# EAGLE schematic 4x1button v19 (EAGLE 9.7.0)

## Sheet 1 of 5
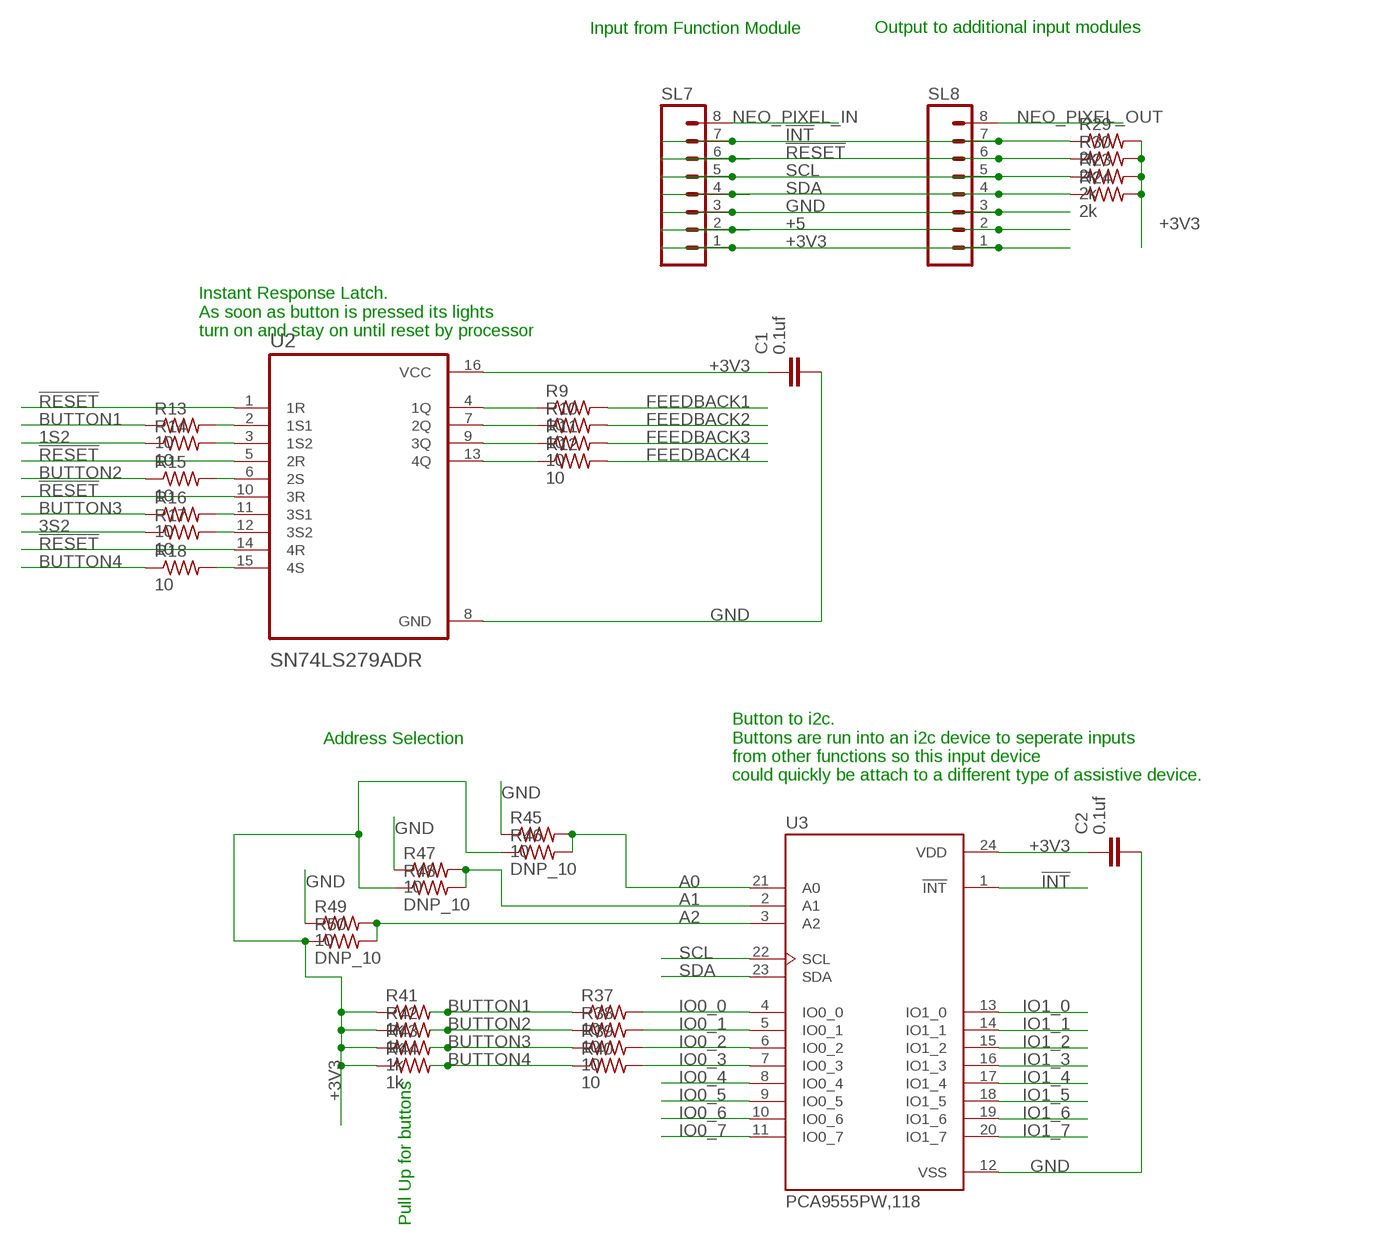
[diagram p0: schematic, sheet 1]

### Parts
C1  0.1uf  C_CHIP-0805(2012-METRIC)  [CAPC2012X110]
C2  0.1uf  C_CHIP-0805(2012-METRIC)  [CAPC2012X110]
R9  10  R-US_R0805  [R0805]
R10  10  R-US_R0805  [R0805]
R11  10  R-US_R0805  [R0805]
R12  10  R-US_R0805  [R0805]
R13  10  R-US_R0805  [R0805]
R14  10  R-US_R0805  [R0805]
R15  10  R-US_R0805  [R0805]
R16  10  R-US_R0805  [R0805]
R17  10  R-US_R0805  [R0805]
R18  10  R-US_R0805  [R0805]
R23  2k  R-US_R0805  [R0805]
R24  2k  R-US_R0805  [R0805]
R29  2k  R-US_R0805  [R0805]
R30  2k  R-US_R0805  [R0805]
R37  10  R-US_R0805  [R0805]
R38  10  R-US_R0805  [R0805]
R39  10  R-US_R0805  [R0805]
R40  10  R-US_R0805  [R0805]
R41  1k  R-US_R0805  [R0805]
R42  1k  R-US_R0805  [R0805]
R43  1k  R-US_R0805  [R0805]
R44  1k  R-US_R0805  [R0805]
R45  10  R-US_R0805  [R0805]
R46  DNP_10  R-US_R0805  [R0805]
R47  10  R-US_R0805  [R0805]
R48  DNP_10  R-US_R0805  [R0805]
R49  10  R-US_R0805  [R0805]
R50  DNP_10  R-US_R0805  [R0805]
SL7  MA08  [08PA]
SL8  MA08  [08PA]
U2  SN74LS279ADR  [SOIC127P600X175-16N]
U3  PCA9555PW,118  [SOP65P640X110-24N]

### Nets
1S2: R14.1
3S2: R17.1
!INT: R29.1 SL7.7 SL8.7 U3.1(!INT)
!RESET: R30.1 SL7.6 SL8.6 U2.1(1R) U2.5(2R) U2.10(3R) U2.14(4R)
+3V3: C1.1 C2.1 R23.2 R24.2 R29.2 R30.2 R41.1 R42.1 R43.1 R44.1 R46.1 R48.1 R50.1 SL7.1 SL8.1 U2.16(VCC) U3.24(VDD) ; also sheet 2,3,4,5
+5: SL7.2 SL8.2 ; also sheet 2,3,4,5
A0: R45.2 R46.2 U3.21(A0)
A1: R47.2 R48.2 U3.2(A1)
A2: R49.2 R50.2 U3.3(A2)
BUTTON1: R13.1 R37.1 R41.2 ; also sheet 2
BUTTON2: R15.1 R38.1 R42.2 ; also sheet 3
BUTTON3: R16.1 R39.1 R43.2 ; also sheet 4
BUTTON4: R18.1 R40.1 R44.2 ; also sheet 5
FEEDBACK1: R9.2 ; also sheet 2
FEEDBACK2: R10.2 ; also sheet 3
FEEDBACK3: R11.2 ; also sheet 4
FEEDBACK4: R12.2 ; also sheet 5
GND: C1.2 C2.2 R45.1 R47.1 R49.1 SL7.3 SL8.3 U2.8(GND) U3.12(VSS) ; also sheet 2,3,4,5
IO0_0: R37.2 U3.4(IO0_0)
IO0_1: R38.2 U3.5(IO0_1)
IO0_2: R39.2 U3.6(IO0_2)
IO0_3: R40.2 U3.7(IO0_3)
IO0_4: U3.8(IO0_4)
IO0_5: U3.9(IO0_5)
IO0_6: U3.10(IO0_6)
IO0_7: U3.11(IO0_7)
IO1_0: U3.13(IO1_0)
IO1_1: U3.14(IO1_1)
IO1_2: U3.15(IO1_2)
IO1_3: U3.16(IO1_3)
IO1_4: U3.17(IO1_4)
IO1_5: U3.18(IO1_5)
IO1_6: U3.19(IO1_6)
IO1_7: U3.20(IO1_7)
N$15: R9.1 U2.4(1Q)
N$16: R10.1 U2.7(2Q)
N$17: R11.1 U2.9(3Q)
N$18: R12.1 U2.13(4Q)
N$19: R13.2 U2.2(1S1)
N$20: R14.2 U2.3(1S2)
N$21: R15.2 U2.6(2S)
N$22: R16.2 U2.11(3S1)
N$23: R17.2 U2.12(3S2)
N$24: R18.2 U2.15(4S)
NEO_PIXEL_IN: SL7.8 ; also sheet 2
NEO_PIXEL_OUT: SL8.8 ; also sheet 5
SCL: R23.1 SL7.5 SL8.5 U3.22(SCL)
SDA: R24.1 SL7.4 SL8.4 U3.23(SDA)

### Notes on the sheet
- Input from Function Module
- Output to additional input modules
- Instant Response Latch.
  As soon as button is pressed its lights
  turn on and stay on until reset by processor
- Address Selection
- Button to i2c.
  Buttons are run into an i2c device to seperate inputs 
  from other functions so this input device 
  could quickly be attach to a different type of assistive device.
- Pull Up for buttons

## Sheet 2 of 5
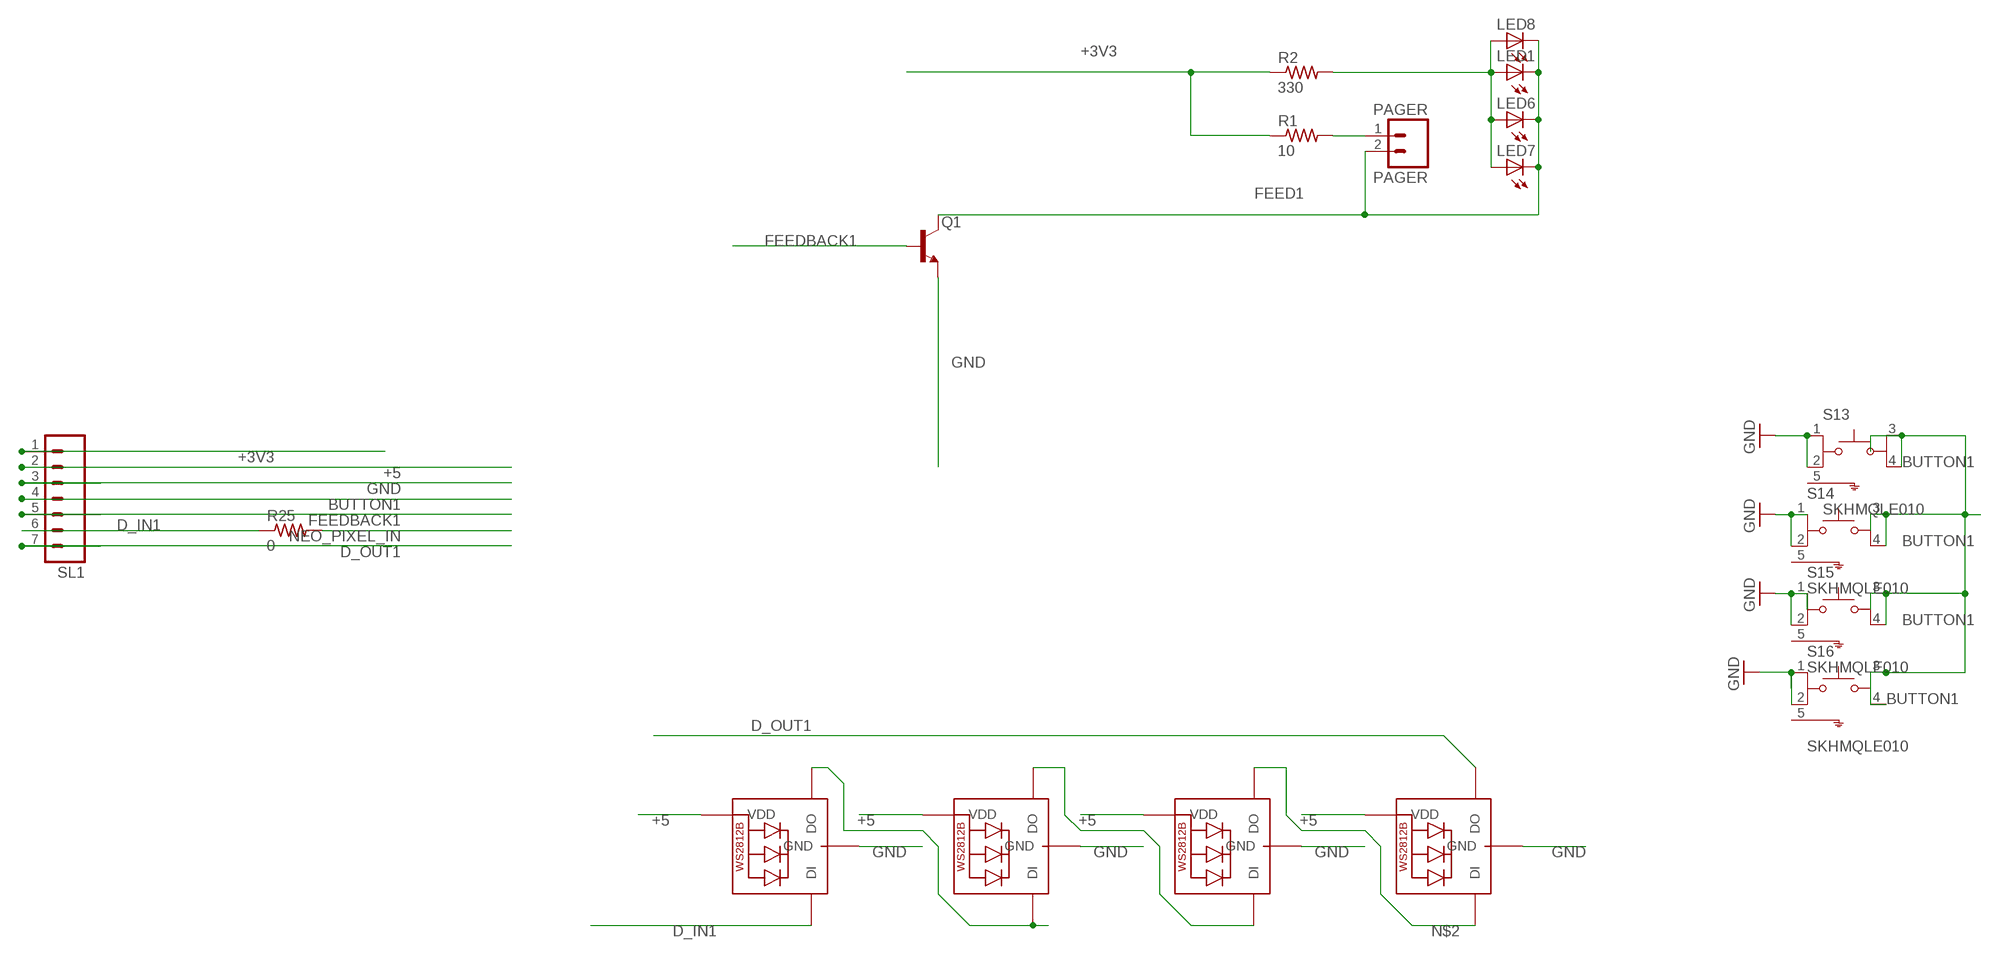
[diagram p1: schematic, sheet 2]

### Parts
LED1  LEDCHIP-LED0805  [CHIP-LED0805]
LED2  WS2812B-V5/W  WS2812B5050  [WS2812B]
LED3  WS2812B-V5/W  WS2812B5050  [WS2812B]
LED4  WS2812B-V5/W  WS2812B5050  [WS2812B]
LED5  WS2812B-V5/W  WS2812B5050  [WS2812B]
LED6  LEDCHIP-LED0805  [CHIP-LED0805]
LED7  LEDCHIP-LED0805  [CHIP-LED0805]
LED8  LEDCHIP-LED0805  [CHIP-LED0805]
PAGER  PAGER  MA02  [02PA]
Q1  MMUN2216  NPN_SOT23-BEC  [SOT95P237X112-3N]
R1  10  R-US_R0805  [R0805]
R2  330  R-US_R0805  [R0805]
R25  0  R-US_R0805  [R0805]
S13  SKHMQLE010  [SW_SKHMQLE010]
S14  SKHMQLE010  [SW_SKHMQLE010]
S15  SKHMQLE010  [SW_SKHMQLE010]
S16  SKHMQLE010  [SW_SKHMQLE010]
SL1  MA07  [07PA]

### Nets
+3V3: R1.1 R2.1 SL1.1 ; also sheet 1,3,4,5
+5: LED2.1-VDD(VDD) LED3.1-VDD(VDD) LED4.1-VDD(VDD) LED5.1-VDD(VDD) SL1.2 ; also sheet 1,3,4,5
BUTTON1: S13.3 S13.4 S14.3 S14.4 S15.3 S15.4 S16.3 S16.4 SL1.4 ; also sheet 1
D_IN1: LED2.4-DIN(DI) R25.1 SL1.6
D_OUT1: LED5.2-DOUT(DO) SL1.7 ; also sheet 3
FEED1: LED1.C LED6.C LED7.C LED8.C PAGER.2 Q1.3(C)
FEEDBACK1: Q1.1(B) SL1.5 ; also sheet 1
GND: LED2.3-GND(GND) LED3.3-GND(GND) LED4.3-GND(GND) LED5.3-GND(GND) Q1.2(E) S13.1 S13.2 S14.1 S14.2 S15.1 S15.2 S16.1 S16.2 SL1.3 ; also sheet 1,3,4,5
N$1: PAGER.1 R1.2
N$2: LED4.2-DOUT(DO) LED5.4-DIN(DI)
N$35: LED1.A LED6.A LED7.A LED8.A R2.2
N$38: LED2.2-DOUT(DO) LED3.4-DIN(DI)
N$39: LED3.2-DOUT(DO) LED4.4-DIN(DI)
NEO_PIXEL_IN: R25.2 ; also sheet 1

## Sheet 3 of 5
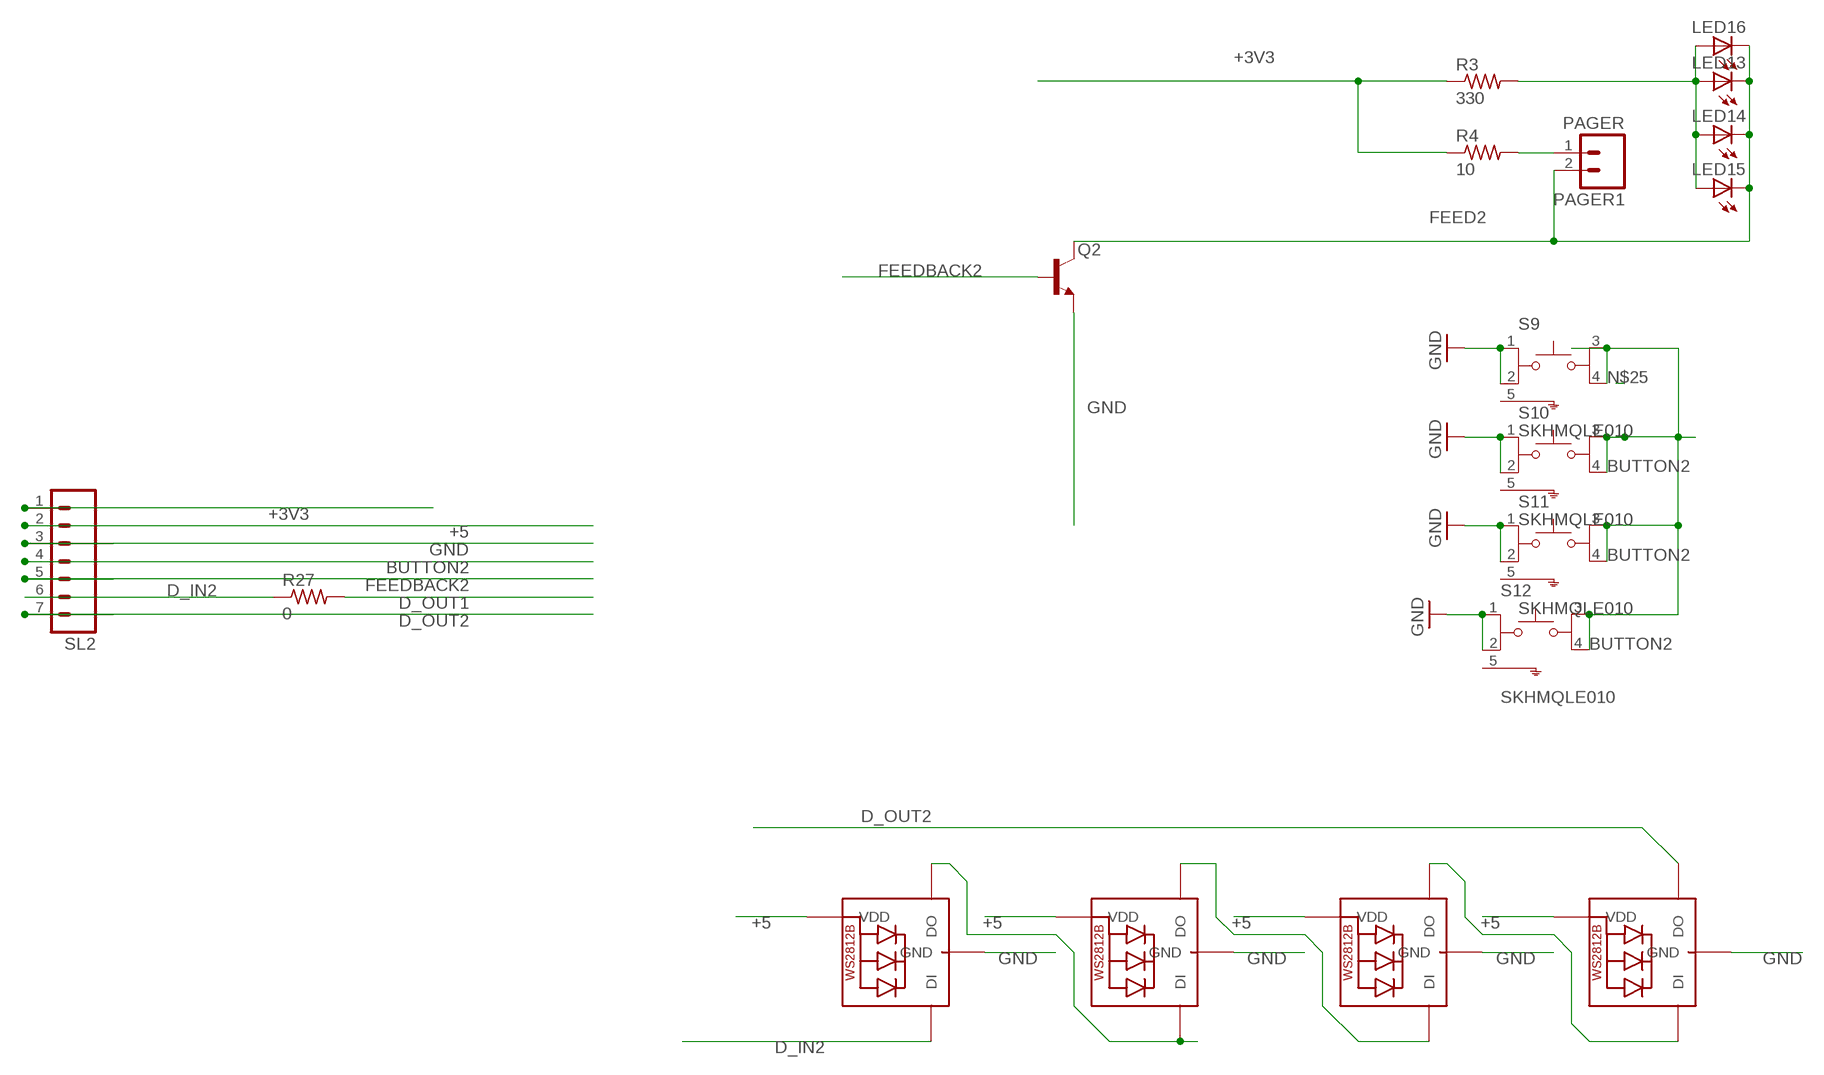
[diagram p2: schematic, sheet 3]

### Parts
LED9  WS2812B-V5/W  WS2812B5050  [WS2812B]
LED10  WS2812B-V5/W  WS2812B5050  [WS2812B]
LED11  WS2812B-V5/W  WS2812B5050  [WS2812B]
LED12  WS2812B-V5/W  WS2812B5050  [WS2812B]
LED13  LEDCHIP-LED0805  [CHIP-LED0805]
LED14  LEDCHIP-LED0805  [CHIP-LED0805]
LED15  LEDCHIP-LED0805  [CHIP-LED0805]
LED16  LEDCHIP-LED0805  [CHIP-LED0805]
PAGER1  PAGER  MA02  [02PA]
Q2  MMUN2216  NPN_SOT23-BEC  [SOT95P237X112-3N]
R3  330  R-US_R0805  [R0805]
R4  10  R-US_R0805  [R0805]
R27  0  R-US_R0805  [R0805]
S9  SKHMQLE010  [SW_SKHMQLE010]
S10  SKHMQLE010  [SW_SKHMQLE010]
S11  SKHMQLE010  [SW_SKHMQLE010]
S12  SKHMQLE010  [SW_SKHMQLE010]
SL2  MA07  [07PA]

### Nets
+3V3: R3.1 R4.1 SL2.1 ; also sheet 1,2,4,5
+5: LED9.1-VDD(VDD) LED10.1-VDD(VDD) LED11.1-VDD(VDD) LED12.1-VDD(VDD) SL2.2 ; also sheet 1,2,4,5
BUTTON2: S9.3 S9.4 S10.3 S10.4 S11.3 S11.4 S12.3 S12.4 SL2.4 ; also sheet 1
D_IN2: LED9.4-DIN(DI) R27.1 SL2.6
D_OUT1: R27.2 ; also sheet 2
D_OUT2: LED12.2-DOUT(DO) SL2.7 ; also sheet 4
FEED2: LED13.C LED14.C LED15.C LED16.C PAGER1.2 Q2.3(C)
FEEDBACK2: Q2.1(B) SL2.5 ; also sheet 1
GND: LED9.3-GND(GND) LED10.3-GND(GND) LED11.3-GND(GND) LED12.3-GND(GND) Q2.2(E) S9.1 S9.2 S10.1 S10.2 S11.1 S11.2 S12.1 S12.2 SL2.3 ; also sheet 1,2,4,5
N$3: LED9.2-DOUT(DO) LED10.4-DIN(DI)
N$4: LED10.2-DOUT(DO) LED11.4-DIN(DI)
N$5: LED13.A LED14.A LED15.A LED16.A R3.2
N$6: PAGER1.1 R4.2
N$31: LED11.2-DOUT(DO) LED12.4-DIN(DI)

## Sheet 4 of 5
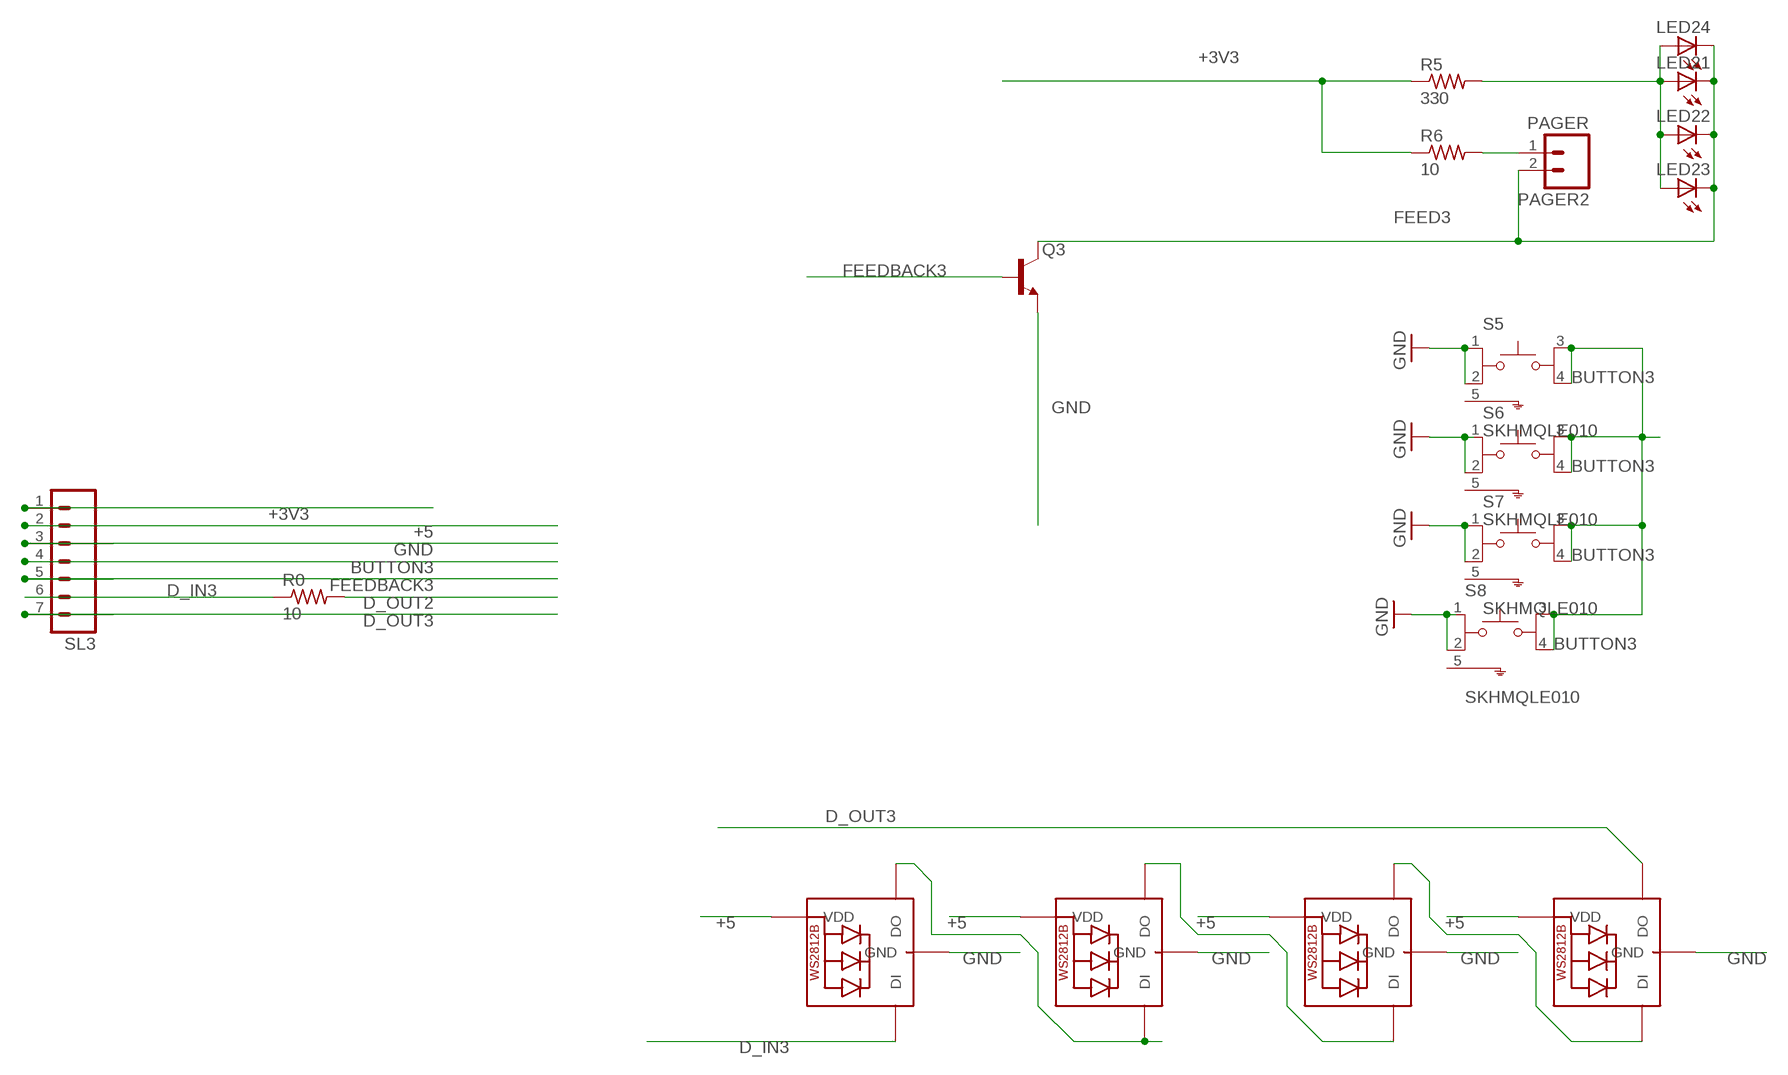
[diagram p3: schematic, sheet 4]

### Parts
LED17  WS2812B-V5/W  WS2812B5050  [WS2812B]
LED18  WS2812B-V5/W  WS2812B5050  [WS2812B]
LED19  WS2812B-V5/W  WS2812B5050  [WS2812B]
LED20  WS2812B-V5/W  WS2812B5050  [WS2812B]
LED21  LEDCHIP-LED0805  [CHIP-LED0805]
LED22  LEDCHIP-LED0805  [CHIP-LED0805]
LED23  LEDCHIP-LED0805  [CHIP-LED0805]
LED24  LEDCHIP-LED0805  [CHIP-LED0805]
PAGER2  PAGER  MA02  [02PA]
Q3  MMUN2216  NPN_SOT23-BEC  [SOT95P237X112-3N]
R0  10  R-US_R0805  [R0805]
R5  330  R-US_R0805  [R0805]
R6  10  R-US_R0805  [R0805]
S5  SKHMQLE010  [SW_SKHMQLE010]
S6  SKHMQLE010  [SW_SKHMQLE010]
S7  SKHMQLE010  [SW_SKHMQLE010]
S8  SKHMQLE010  [SW_SKHMQLE010]
SL3  MA07  [07PA]

### Nets
+3V3: R5.1 R6.1 SL3.1 ; also sheet 1,2,3,5
+5: LED17.1-VDD(VDD) LED18.1-VDD(VDD) LED19.1-VDD(VDD) LED20.1-VDD(VDD) SL3.2 ; also sheet 1,2,3,5
BUTTON3: S5.3 S5.4 S6.3 S6.4 S7.3 S7.4 S8.3 S8.4 SL3.4 ; also sheet 1
D_IN3: LED17.4-DIN(DI) R0.1 SL3.6
D_OUT2: R0.2 ; also sheet 3
D_OUT3: LED20.2-DOUT(DO) SL3.7 ; also sheet 5
FEED3: LED21.C LED22.C LED23.C LED24.C PAGER2.2 Q3.3(C)
FEEDBACK3: Q3.1(B) SL3.5 ; also sheet 1
GND: LED17.3-GND(GND) LED18.3-GND(GND) LED19.3-GND(GND) LED20.3-GND(GND) Q3.2(E) S5.1 S5.2 S6.1 S6.2 S7.1 S7.2 S8.1 S8.2 SL3.3 ; also sheet 1,2,3,5
N$7: LED17.2-DOUT(DO) LED18.4-DIN(DI)
N$8: LED18.2-DOUT(DO) LED19.4-DIN(DI)
N$9: LED21.A LED22.A LED23.A LED24.A R5.2
N$10: PAGER2.1 R6.2
N$30: LED19.2-DOUT(DO) LED20.4-DIN(DI)

## Sheet 5 of 5
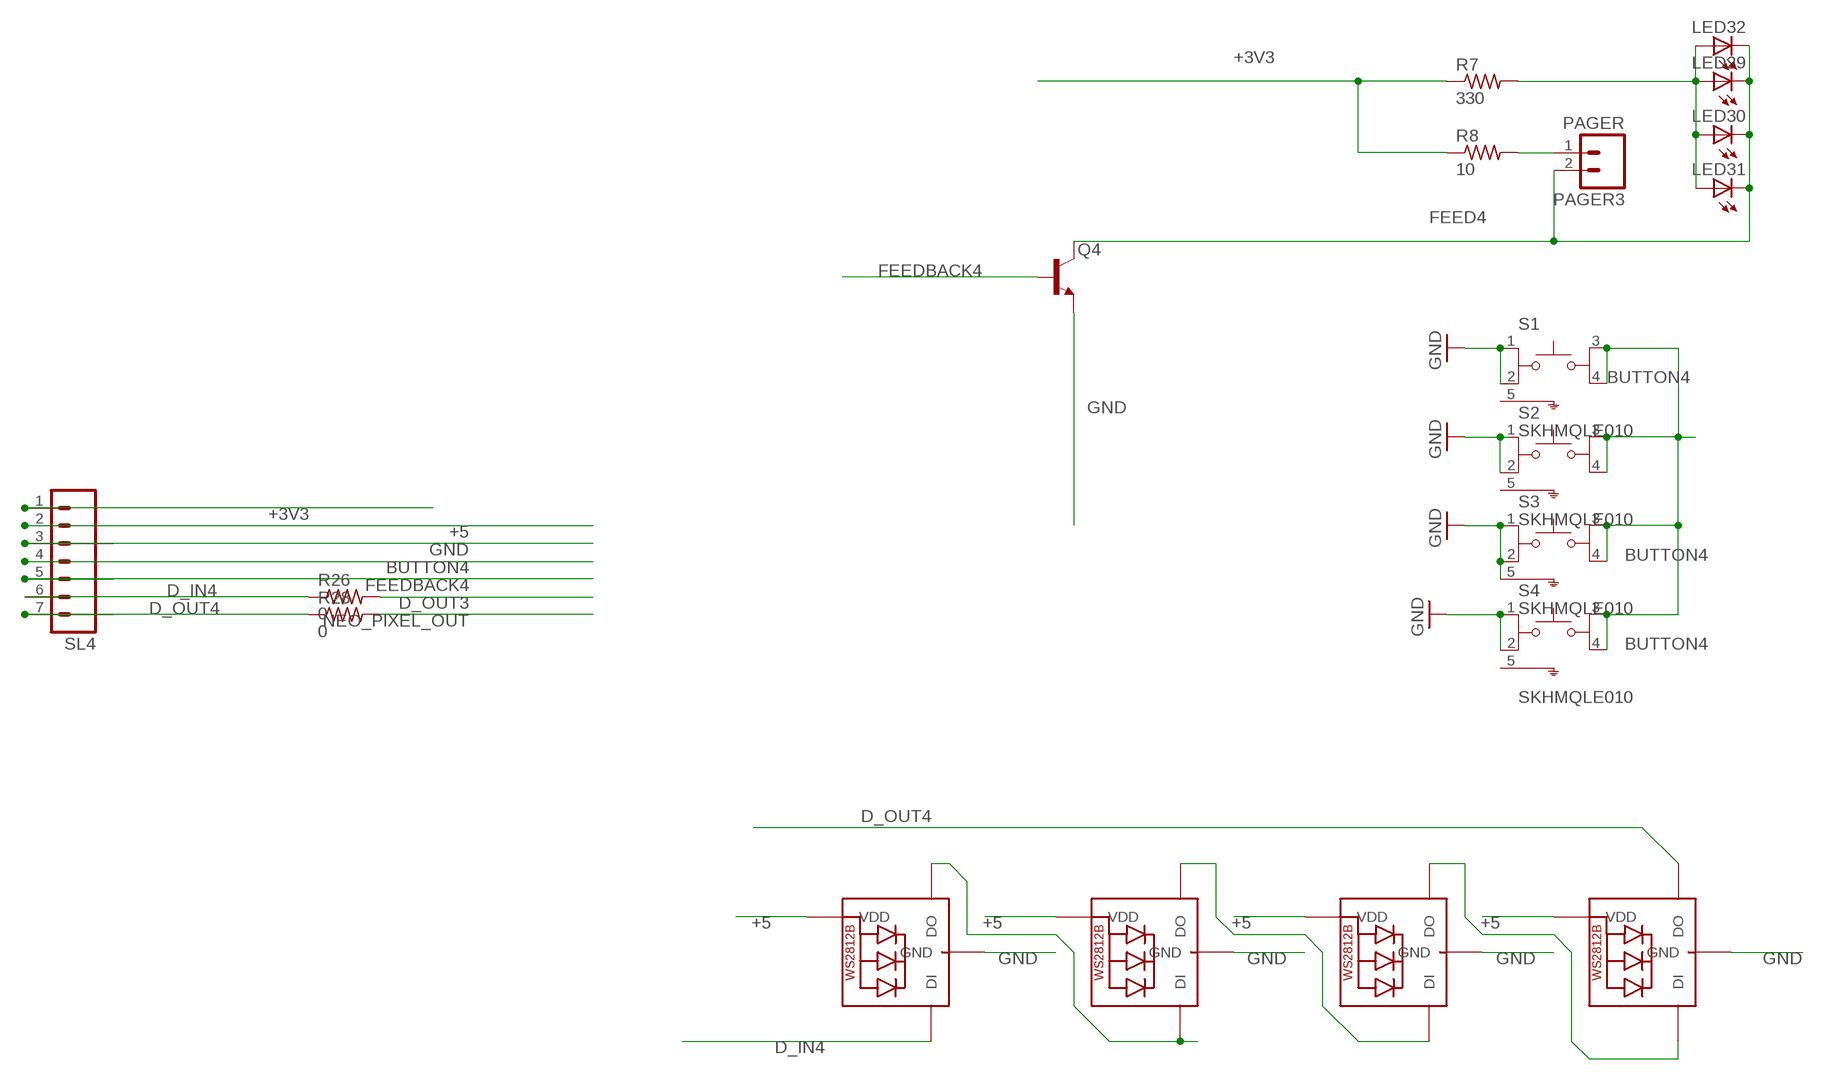
[diagram p4: schematic, sheet 5]

### Parts
LED25  WS2812B-V5/W  WS2812B5050  [WS2812B]
LED26  WS2812B-V5/W  WS2812B5050  [WS2812B]
LED27  WS2812B-V5/W  WS2812B5050  [WS2812B]
LED28  WS2812B-V5/W  WS2812B5050  [WS2812B]
LED29  LEDCHIP-LED0805  [CHIP-LED0805]
LED30  LEDCHIP-LED0805  [CHIP-LED0805]
LED31  LEDCHIP-LED0805  [CHIP-LED0805]
LED32  LEDCHIP-LED0805  [CHIP-LED0805]
PAGER3  PAGER  MA02  [02PA]
Q4  MMUN2216  NPN_SOT23-BEC  [SOT95P237X112-3N]
R7  330  R-US_R0805  [R0805]
R8  10  R-US_R0805  [R0805]
R26  0  R-US_R0805  [R0805]
R28  0  R-US_R0805  [R0805]
S1  SKHMQLE010  [SW_SKHMQLE010]
S2  SKHMQLE010  [SW_SKHMQLE010]
S3  SKHMQLE010  [SW_SKHMQLE010]
S4  SKHMQLE010  [SW_SKHMQLE010]
SL4  MA07  [07PA]

### Nets
+3V3: R7.1 R8.1 SL4.1 ; also sheet 1,2,3,4
+5: LED25.1-VDD(VDD) LED26.1-VDD(VDD) LED27.1-VDD(VDD) LED28.1-VDD(VDD) SL4.2 ; also sheet 1,2,3,4
BUTTON4: S1.3 S1.4 S2.3 S2.4 S3.3 S3.4 S4.3 S4.4 SL4.4 ; also sheet 1
D_IN4: LED25.4-DIN(DI) R26.1 SL4.6
D_OUT3: R26.2 ; also sheet 4
D_OUT4: LED28.2-DOUT(DO) R28.1 SL4.7
FEED4: LED29.C LED30.C LED31.C LED32.C PAGER3.2 Q4.3(C)
FEEDBACK4: Q4.1(B) SL4.5 ; also sheet 1
GND: LED25.3-GND(GND) LED26.3-GND(GND) LED27.3-GND(GND) LED28.3-GND(GND) Q4.2(E) S1.1 S1.2 S2.1 S2.2 S3.1 S3.2 S3.5 S4.1 S4.2 SL4.3 ; also sheet 1,2,3,4
N$11: LED25.2-DOUT(DO) LED26.4-DIN(DI)
N$12: LED26.2-DOUT(DO) LED27.4-DIN(DI)
N$13: LED29.A LED30.A LED31.A LED32.A R7.2
N$14: PAGER3.1 R8.2
N$29: LED27.2-DOUT(DO) LED28.4-DIN(DI)
NEO_PIXEL_OUT: R28.2 ; also sheet 1

## Power pins joined to a net without a drawn wire
5: S1.5 S2.5 S4.5 S5.5 S6.5 S7.5 S8.5 S9.5 S10.5 S11.5 S12.5 S13.5 S14.5 S15.5 S16.5

## Library data of the parts
C1 C2 = Capacitor:C: Capacitor - Generic; CATEGORY: Capacitor; PACKAGE_SIZE: 0805; PACKAGE_TYPE: SMD; SUBCATEGORY: Ceramic Capacitors; TYPE: MLCC
LED1 LED6-LED8 LED13-LED16 LED21-LED24 LED29-LED32 = adafruit:LED: LED OSRAM: - CHIPLED LG R971, LG N971, LY N971, LG Q971, LY Q971, LO R971, LY R971 LH N974, LH R974 LS Q976, LO Q976, LY Q976 LO Q996 - Hyper CHIPLED LW Q18S LB Q993, LB Q99A, LB R99A - SideLED LS A670, LO A670, LY A670, LG A670, LP A670 LB A673, LV A673, LT A673, LW A673 LH A674 LY A675 LS A676, LA A676, LO A676, LY A676, LW A676 LS A679, LY A679, LG A679 - Hyper Micro SIDELED® LS Y876, LA Y876, LO Y876, LY Y876 LT Y87S - SmartLED LW L88C, LW L88S LB L89C, LB L89S, LG L890 LS L89K, LO L89K, LY L89K LS L896, LA L896, LO L896, LY L896 - TOPLED LS T670, LO T670, LY T670, LG T670, LP T670 LSG T670, LSP T670, LSY T670, LOP T670, LYG T670 LG T671, LOG T671, LSG T671 LB T673, LV T673, LT T673, LW T673 LH T674 LS T676, LA T676, LO T676, LY T676, LB T676, LH T676, LSB T676, LW T676 LB T67C, LV T67C, LT T67C, LS T67K, LO T67K, LY T67K, LW E67C LS E67B, LA E67B, LO E67B, LY E67B, LB E67C, LV E67C, LT E67C LW T67C LS T679, LY T679, LG T679 LS T770, LO T770, LY T770, LG T770, LP T770 LB T773, LV T773, LT T773, LW T773 LH T774 LS E675, LA E675, LY E675, LS T675 LS T776, LA T776, LO T776, LY T776, LB T776 LHGB T686 LT T68C, LB T68C - Hyper Mini TOPLED® LB M676 - Mini TOPLED Santana® LG M470 LS M47K, LO M47K, LY M47K Source: http://www.osram.convergy.de/
LED2-LED5 LED9-LED12 LED17-LED20 LED25-LED28 = adafruit:WS2812B
PAGER PAGER1-PAGER3 = con-amp-quick:MA02: AMP QUICK CONNECTOR; OC_FARNELL: unknown; OC_NEWARK: unknown
Q1-Q4 = Transistor:NPN: NPN Transistor - Generic; CATEGORY: Transistor; DATASHEET: https://www.analog.com/media/en/package-pcb-resources/package/pkg_pdf/ltc-legacy-sot-23/sot3%2005-08-1631%20rev%20d.pdf; DESCRIPTION: Generic NPN Transistor Surface Mount SOT23-BEC Package; PACKAGE_SIZE: SOT-23; PACKAGE_TYPE: SMD; SUBCATEGORY: BJT; TYPE: NPN
R0 R1-R18 R23-R30 R37-R50 = adafruit:R-US_: RESISTOR, American symbol
S1-S16 = SKHMQLE010:SKHMQLE010; MANUFACTURER: E-Switch; MAXIMUM_PACKAGE_HEIGHT: 3.4 mm; STANDARD: Manufacturer Recommendations
SL1-SL4 = con-amp-quick:MA07: AMP QUICK CONNECTOR; OC_FARNELL: unknown; OC_NEWARK: unknown
SL7 SL8 = con-amp-quick:MA08: AMP QUICK CONNECTOR; OC_FARNELL: unknown; OC_NEWARK: unknown
U2 = SN74LS279ADR:SN74LS279ADR
U3 = PCA9555PW_118:PCA9555PW,118; MANUFACTURER: NXP; MAXIMUM_PACKAGE_HEIGHT: 1.1mm; PARTREV: 10; STANDARD: IPC 7351B